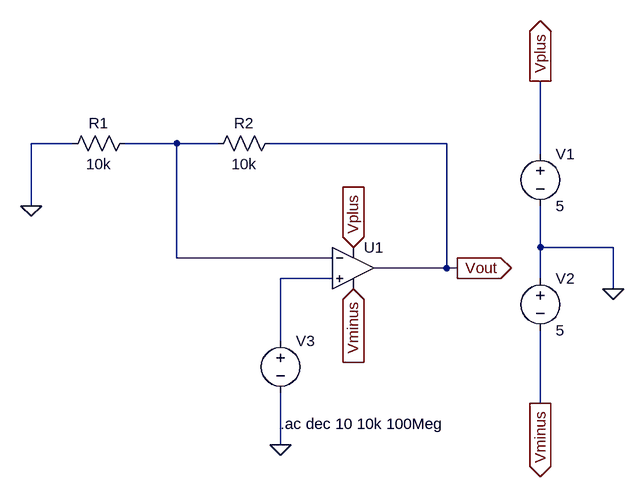
[diagram p0: schematic universal op amp.asc]
universal op amp.asc, the LTspice schematic file:
Version 4
SHEET 1 944 716
WIRE 96 192 32 192
WIRE 256 192 176 192
WIRE 320 192 256 192
WIRE 672 192 400 192
WIRE 816 208 816 96
WIRE 32 288 32 192
WIRE 816 352 816 288
WIRE 928 352 816 352
WIRE 256 368 256 192
WIRE 496 368 256 368
WIRE 672 384 672 192
WIRE 672 384 560 384
WIRE 688 384 672 384
WIRE 496 400 416 400
WIRE 816 400 816 352
WIRE 928 416 928 352
WIRE 416 496 416 400
WIRE 816 592 816 480
WIRE 416 656 416 576
FLAG 928 416 0
FLAG 416 656 0
FLAG 32 288 0
FLAG 816 96 Vplus
IOPIN 816 96 Out
FLAG 816 592 Vminus
IOPIN 816 592 Out
FLAG 528 352 Vplus
IOPIN 528 352 In
FLAG 528 416 Vminus
IOPIN 528 416 In
FLAG 688 384 Vout
IOPIN 688 384 Out
SYMBOL res 192 176 R90
WINDOW 0 0 56 VBottom 2
WINDOW 3 32 56 VTop 2
SYMATTR InstName R1
SYMATTR Value 10k
SYMBOL res 416 176 R90
WINDOW 0 0 56 VBottom 2
WINDOW 3 32 56 VTop 2
SYMATTR InstName R2
SYMATTR Value 10k
SYMBOL OpAmps/UniversalOpAmp 528 384 R0
SYMATTR InstName U1
SYMBOL voltage 816 192 R0
SYMATTR InstName V1
SYMATTR Value 5
SYMBOL voltage 816 384 R0
SYMATTR InstName V2
SYMATTR Value 5
SYMBOL voltage 416 480 R0
SYMATTR InstName V3
SYMATTR Value ""
SYMATTR Value2 AC 1
TEXT 416 624 Left 2 !.ac dec 10 10k 100Meg

The netlist it stands for:
* universal op amp.asc
R1 N001 0 10k
R2 Vout N001 10k
XU1 N002 N001 Vplus Vminus Vout level1 Avol=1Meg GBW=10Meg Vos=0 En=0 Enk=0 In=0 Ink=0 Rin=500Meg  ; pins In+ In- V+ V- OUT
V1 Vplus 0 5
V2 0 Vminus 5
V3 N002 0 AC 1
.ac dec 10 10k 100Meg
.lib UniversalOpAmp1.lib
.backanno
.end